# Altium schematic sheet commande.SchDoc
size A4; SheetNumber: 4; SheetTotal: 7
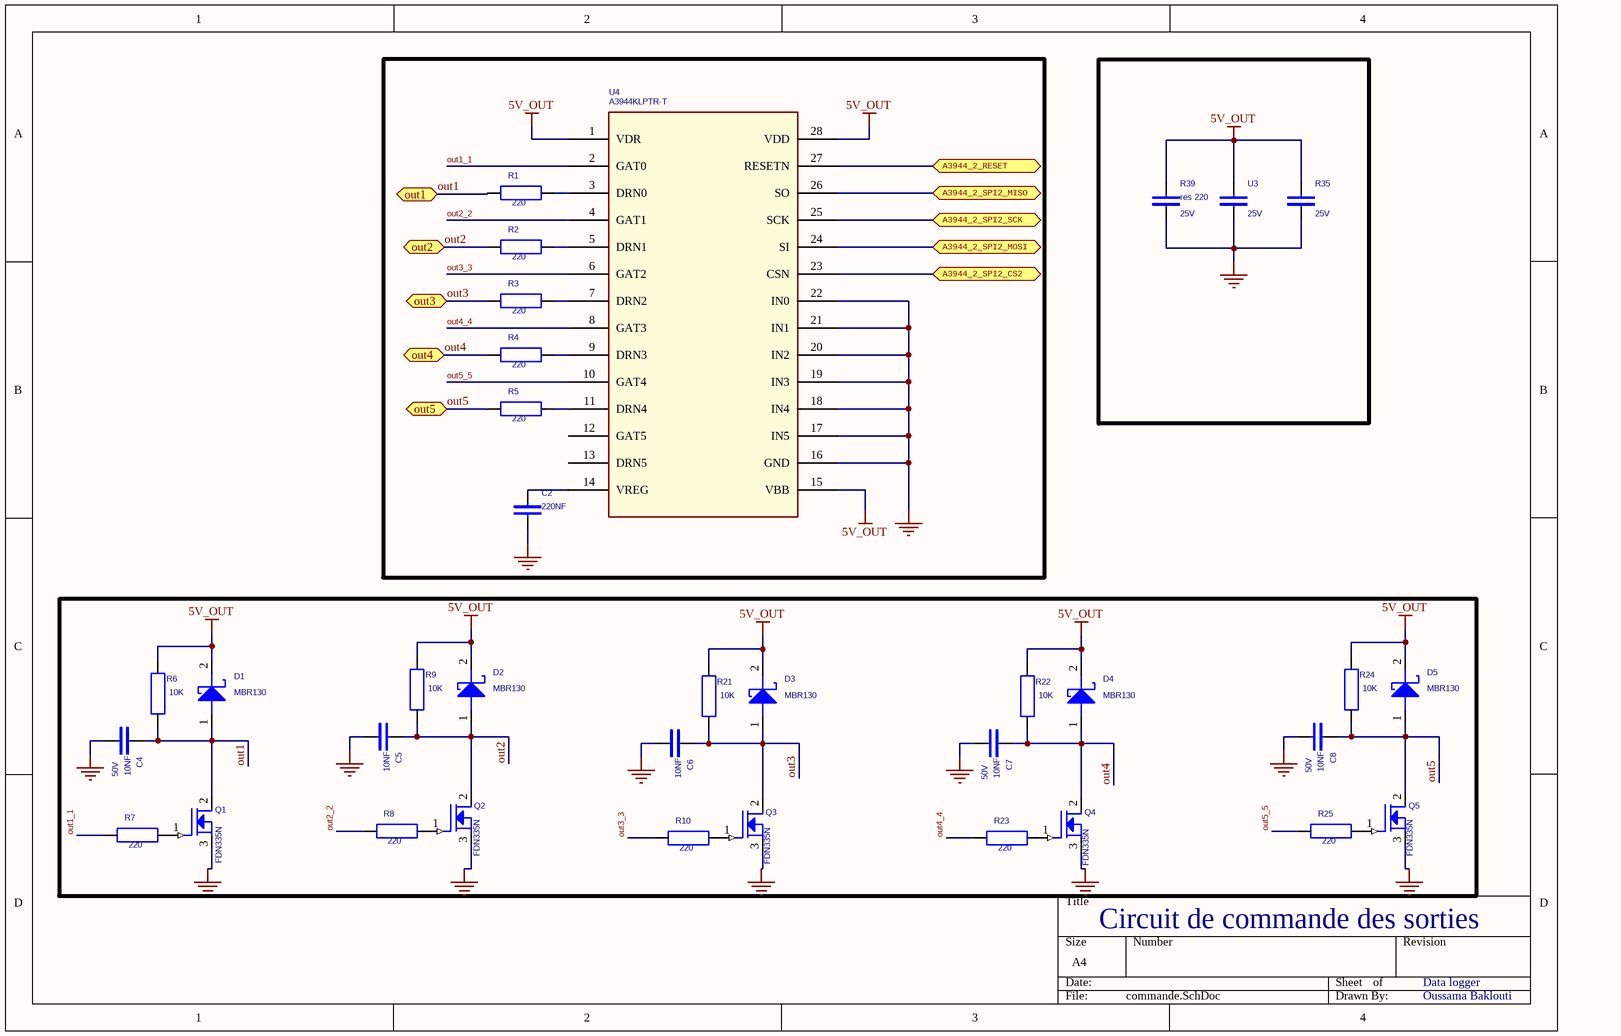
[diagram p0: commande.SchDoc]

## Parts
C2  220NF  [cap 220uF 50v]
C4  10NF  Voltage: 50V  [cap 10nF 50V]
C5  10NF  [cap 10nF 50V]
C6  10NF  [cap 10nF 50V]
C7  10NF  Voltage: 50V  [cap 10nF 50V]
C8  10NF  Voltage: 50V  [cap 10nF 50V]
D1  MBR130  [diode skotty]
D2  MBR130  [diode skotty]
D3  MBR130  [diode skotty]
D4  MBR130  [diode skotty]
D5  MBR130  [diode skotty]
Q1  FDN335N  [FDN335N]
Q2  FDN335N  [FDN335N]
Q3  FDN335N  [FDN335N]
Q4  FDN335N  [FDN335N]
Q5  FDN335N  [FDN335N]
R1  220  [res 220]
R2  220  [res 220]
R3  220  [res 220]
R4  220  [res 220]
R5  220  [res 220]
R6  10K  [RES_10k]
R7  220  [res 220]
R8  220  [res 220]
R9  10K  [RES_10k]
R10  220  [res 220]
R21  10K  [RES_10k]
R22  10K  [RES_10k]
R23  220  [res 220]
R24  10K  [RES_10k]
R25  220  [res 220]
R35  Voltage: 25V  [RES 220]
R39  res 220  Voltage: 25V  [RES 220]
U3  Voltage: 25V  [LILYGO-T-CALL-SIM800L]
U4  A3944KLPTR-T  [SOP65P640X265_HS-29N]

## Ports
A3944_2_RESET (bidir), A3944_2_SPI2_CS2 (bidir), A3944_2_SPI2_MISO (bidir), A3944_2_SPI2_MOSI (bidir), A3944_2_SPI2_SCK (bidir), out1 (bidir), out2 (bidir), out3 (bidir), out4 (bidir), out5 (bidir)

## Nets
5V_OUT: D1.2(K) D2.2(K) D3.2(K) D4.2(K) D5.2(K) R6.1 R9.1 R21.1 R22.1 R24.1 R35.1 R39.1 U3.1 U4.1(VDR) U4.15(VBB) U4.28(VDD)
GND: C2.2 C4.2 C5.2 C6.2 C7.2 C8.2 Q1.3(SOURCE) Q2.3(SOURCE) Q3.3(SOURCE) Q4.3(SOURCE) Q5.3(SOURCE) R35.2 R39.2 U3.2 U4.16(GND) U4.17(IN5) U4.18(IN4) U4.19(IN3) U4.20(IN2) U4.21(IN1) U4.22(IN0)
A3944_2_RESET: U4.27(RESETN) ; port A3944_2_RESET
A3944_2_SPI2_CS2: U4.23(CSN) ; port A3944_2_SPI2_CS2
A3944_2_SPI2_MISO: U4.26(SO) ; port A3944_2_SPI2_MISO
A3944_2_SPI2_MOSI: U4.24(SI) ; port A3944_2_SPI2_MOSI
A3944_2_SPI2_SCK: U4.25(SCK) ; port A3944_2_SPI2_SCK
out1: C4.1 D1.1(A) Q1.2(DRAIN) R1.2 R6.2 ; port out1
out1_1: R7.2 U4.2(GAT0)
out2: C5.1 D2.1(A) Q2.2(DRAIN) R2.2 R9.2 ; port out2
out2_2: R8.2 U4.4(GAT1)
out3: C6.1 D3.1(A) Q3.2(DRAIN) R3.2 R21.2 ; port out3
out3_3: R10.2 U4.6(GAT2)
out4: C7.1 D4.1(A) Q4.2(DRAIN) R4.2 R22.2 ; port out4
out4_4: R23.2 U4.8(GAT3)
out5: C8.1 D5.1(A) Q5.2(DRAIN) R5.2 R24.2 ; port out5
out5_5: R25.2 U4.10(GAT4)
NetC2_1: C2.1 U4.14(VREG)
NetQ1_1: Q1.1(GATE) R7.1
NetQ2_1: Q2.1(GATE) R8.1
NetQ3_1: Q3.1(GATE) R10.1
NetQ4_1: Q4.1(GATE) R23.1
NetQ5_1: Q5.1(GATE) R25.1
NetR1_1: R1.1 U4.3(DRN0)
NetR2_1: R2.1 U4.5(DRN1)
NetR3_1: R3.1 U4.7(DRN2)
NetR4_1: R4.1 U4.9(DRN3)
NetR5_1: R5.1 U4.11(DRN4)

Not connected (* = marked no-connect by the designer): U4 12(GAT5) 13(DRN5)

## Notes on the sheet
- Circuit de commande des sorties
- Data logger
- Oussama Baklouti

## Library data of the parts
C2 = CAPA_Dup1: Aluminium Electrolytic Capacitors - SMD 50volts 0.22uF AEC-Q200; Mfr: Nichicon; Mfr réf: UWP1HR22MCL1GB; Supplier: Mouser; Supplier réf: 647-UWP1HR22MCL; Price: 0.63$
C4 = CAPA_Dup1: 10000 pF ±10% 50V Ceramic Capacitor X7R 0402 (1005 Metric); Part Number: AY15800014; Manufacturer1: SAMSUNG; Manufacturer Ref1: CL05B103KB5NNND; Part_Type: CAP_0402; Mfr: Murata Electronics; Mfr réf: GRM155R71H103KA88D; ARDIA PN: 11-1522-01; Description2: -55/125C; Description1: C SMD X7R 0402 10nF 50V 10%; OptionFab: /RoHS/260 /0   /0; Standard Price: 0; Annual Usage: 63 251 069; Packing: PCE; Supply family: CAP; PcbFootprint length: 1,7; PcbFootprint Width: 0,6; PcbFootprint Height: 0,55; Manufacturer Ref9: 2238 587 15636'; Manufacturer9: PHYCOMP; Manufacturer Ref8: CL05B103KB5NNNC; Manufacturer8: SAMSUNG; Manufacturer Ref7: CGA2B3X7R1H103K050BB; Manufacturer7: TDK; Manufacturer Ref6: GCM155R71H103KA55D; Manufacturer6: MURATA; Manufacturer Ref5: CC0402KRX7R9BB103; Manufacturer5: YAGEO; Manufacturer Ref4: CL05B103KB5VPNC; Manufacturer4: SAMSUNG; Manufacturer Ref3: C0402C103K5RACTU; Manufacturer3: KEMET; Status: 20; Tolerance: 10%; Type: CERAMIC; Housing: 0402; Stock: 8 686 433; Family: C_COMMON; Manufacturer2: MURATA; Manufacturer Ref2: GRM155R71H103KA88D; Part Order Code: AY15800014; PcbFootprint Pdf: https://view.actiacity.com/alfresco/webdav/CAD_Elec/PCB_footprint_PDF/CNC/S0402%23A.pdf; Supplier: DigiKey; Supplier réf: 490-4516-6-ND
C5 C6 = CAPA_Dup1: 10000 pF ±10% 50V Ceramic Capacitor X7R 0402 (1005 Metric); Mfr: Murata Electronics; Mfr réf: GRM155R71H103KA88D; Supplier: DigiKey; Supplier réf: 490-4516-6-ND
  C6: Price: 0.10$
C7 C8 = CAPA_Dup1: 10000 pF ±10% 50V Ceramic Capacitor X7R 0402 (1005 Metric); Part Number: AY15800014; Manufacturer1: SAMSUNG; Manufacturer Ref1: CL05B103KB5NNND; Part_Type: CAP_0402; Mfr: Murata Electronics; Mfr réf: GRM155R71H103KA88D; ARDIA PN: 11-1522-01; Description2: -55/125C; Description1: C SMD X7R 0402 10nF 50V 10%; OptionFab: /RoHS/260 /0   /0; Standard Price: 0; Annual Usage: 63 251 069; Packing: PCE; Supply family: CAP; PcbFootprint length: 1,7; PcbFootprint Width: 0,6; PcbFootprint Height: 0,55; PcbFootprint PinNumber: 2; PcbFootprint Type: SMD; PcbFootprint Pitch: 1,05; TypeFab: SMD1; Devise: EUR; Manufacturer Ref9: 2238 587 15636'; Manufacturer9: PHYCOMP; Manufacturer Ref8: CL05B103KB5NNNC; Manufacturer8: SAMSUNG; Manufacturer Ref7: CGA2B3X7R1H103K050BB; Manufacturer7: TDK; Manufacturer Ref6: GCM155R71H103KA55D; Manufacturer6: MURATA; Manufacturer Ref5: CC0402KRX7R9BB103; Manufacturer5: YAGEO; Manufacturer Ref4: CL05B103KB5VPNC; Manufacturer4: SAMSUNG; Manufacturer Ref3: C0402C103K5RACTU; Manufacturer3: KEMET; Status: 20; Tolerance: 10%; Type: CERAMIC; Housing: 0402; Stock: 8 686 433; Family: C_COMMON; Manufacturer2: MURATA; Manufacturer Ref2: GRM155R71H103KA88D; Part Order Code: AY15800014; PcbFootprint Pdf: https://view.actiacity.com/alfresco/webdav/CAD_Elec/PCB_footprint_PDF/CNC/S0402%23A.pdf; Not For New Design: 0; Standard Price Devise: 0; Supplier: DigiKey; Supplier réf: 490-4516-6-ND
D1-D5 = DIODE_SCHOT: Schottky Diodes & Rectifiers 1A 30V; Mfr: onsemi; Mfr réf: MBR130T1G; Supplier: Mouser; Supplier réf: 863-MBR130T1G
  D1: Price: 0.31$
Q1-Q5 = MOSFET N: MOSFET SSOT-3 N-CH 20V; Mfr: onsemi / Fairchild; Supplier: Mouser; Supplier réf: 512-FDN335N; Mfr réf: FDN335N
  Q1: Price: 0.40$
R1-R5 R7 R8 R10 R23 R25 = RE: Thick Film Resistors - SMD 1/2watt 220ohms 1% High Power AEC-Q200; Mfr: Vishay / Dale; Mfr réf: CRCW0805220RFKEAHP; Supplier: Mouser; Supplier réf: 71-CRCW0805220RFKEAH; Footprint: R0805
R6 R9 R21 R22 R24 = RE: Thick Film Resistors - SMD ResHighPowerA 0805 10k 1% 1/2W TC100; Mfr: Bourns; Mfr réf: CMP0805AFX-1002ELF; Supplier: Mouser; Supplier réf: 652-CMP0805AFX-1002L; Footprint: R0805
R35 U3 = CAPA_Dup1: Part Order Code: AY15620002; Part_Type: CAP_0603; Manufacturer Ref10: CL10B104KA85PNC; Manufacturer10: SAMSUNG; Manufacturer Ref1: CC0603KRX7R8BB104; Manufacturer1: YAGEO; Devise: EUR; Standard Price Devise: 0; TypeFab: SMD1; PcbFootprint Pitch: 1,38; PcbFootprint Type: SMD; PcbFootprint PinNumber: 2; PcbFootprint Height: 1; PcbFootprint Width: 1,1; PcbFootprint length: 2,3; Specification: 02/07/03 FOOTPRINT : S0603  DEVIENT  S0603R**************ATTENTION COMPOSANT AERONAUTIQUE**************         AJOUT REF FAB  TDK : C1608 X7R1H104 KT         AJOUT REF FAB  SAMSUNG : CL10B104KBNC*   CES COMPOSANTS DOIVENT ETRE LIVRES ACCOMPAGNES D''UN; Supply family: CAP; Packing: PCE; Annual Usage: 12 962 659; OptionFab: /RoHS/260 /0   /0; Description1: C SMD X7R 0603 100nF 25V 10%; Tolerance: 10%; ARDIA PN: 11-1525-01; Not For New Design: 0; PcbFootprint Pdf: https://view.actiacity.com/alfresco/webdav/CAD_Elec/PCB_footprint_PDF/CNC/S0603R%23A.pdf; Manufacturer Ref9: C0603T104K3RACTU; Manufacturer9: KEMET; Manufacturer Ref8: CGA3E2X7R1E104K080AA; Manufacturer8: TDK; Manufacturer Ref7: HMK107B7104KA-T; Manufacturer7: TAIYO YUDE; Manufacturer Ref6: TMK107B7104KAHT; Manufacturer6: TAIYO YUDE; Manufacturer Ref5: TMF107B7104KAHT; Manufacturer5: TAIYO YUDE; Manufacturer Ref4: C0603C104K5RAC7411; Manufacturer4: KEMET; Manufacturer Ref3: GRM188R71E104KA01J; Manufacturer3: MURATA; Manufacturer Ref2: GRM188R71E104KA01D; Manufacturer2: MURATA; Family: C_COMMON; Stock: 107 520; Standard Price: 0; Housing: 0603; Type: CERAMIC; Status: 20; Part Number: AY15620002
R39 = CAPA_Dup1: Part Order Code: AY15510021; Part_Type: CAP_0805; Manufacturer Ref10: CL21A475KAQNNNG; Manufacturer10: SAMSUNG; Manufacturer Ref1: CL21A475KAQNNNE; Devise: EUR; Standard Price Devise: 0; TypeFab: SMD1; PcbFootprint Pitch: 1,8; PcbFootprint Type: SMD; PcbFootprint PinNumber: 2; PcbFootprint Height: 0,95; PcbFootprint Width: 1,6; PcbFootprint length: 3; Specification: estimation Clef a confirmer; Supply family: CAP; Packing: PCE; Annual Usage: 2 324 678; OptionFab: /SPb /260 /1   /0; Description1: C SMD X5R 0805 4.7uF 25V 10%; Tolerance: 10%; ARDIA PN: 11-1504-01; Not For New Design: 0; PcbFootprint Pdf: https://view.actiacity.com/alfresco/webdav/CAD_Elec/PCB_footprint_PDF/CNC/S0805R%23A.pdf; Manufacturer Ref9: CC0805KKX7R8BB475; Manufacturer9: YAGEO; Manufacturer Ref8: 0805X475K100CT; Manufacturer8: WALSIN; Manufacturer Ref7: CGA4J3X5R1V475K125AB; Manufacturer7: TDK; Manufacturer Ref6: CGA4J3X5R1E475K125AB; Manufacturer6: TDK; Manufacturer Ref5: TMK212BBJ475KGHT; Manufacturer5: TAIYO YUDE; Manufacturer Ref4: TMK212AB7475KG-T; Manufacturer4: TAIYO YUDE; Manufacturer Ref3: TMK212ABJ475KG-T; Manufacturer3: TAIYO YUDE; Manufacturer Ref2: 08053D475KAT2A; Manufacturer2: AVX; Manufacturer1: SAMSUNG; Family: C_COMMON; Stock: 72 862; Standard Price: 0; Housing: 0805; Type: CERAMIC; Status: 20; Part Number: AY15510021
U4 = A3944KLPTR-T: Motor/Motion/Ignition Controllers & Drivers AUTOMOTIVE SIX CHANNEL LOW SIDE MOSFET PRE-DRIVER; Mfr: Mfr.:Allegro MicroSystems; Supplier: Mouser; Supplier réf: 250-A3944KLPTR-T; Mfr réf: A3944KLPTR-T; Price: 2.67$